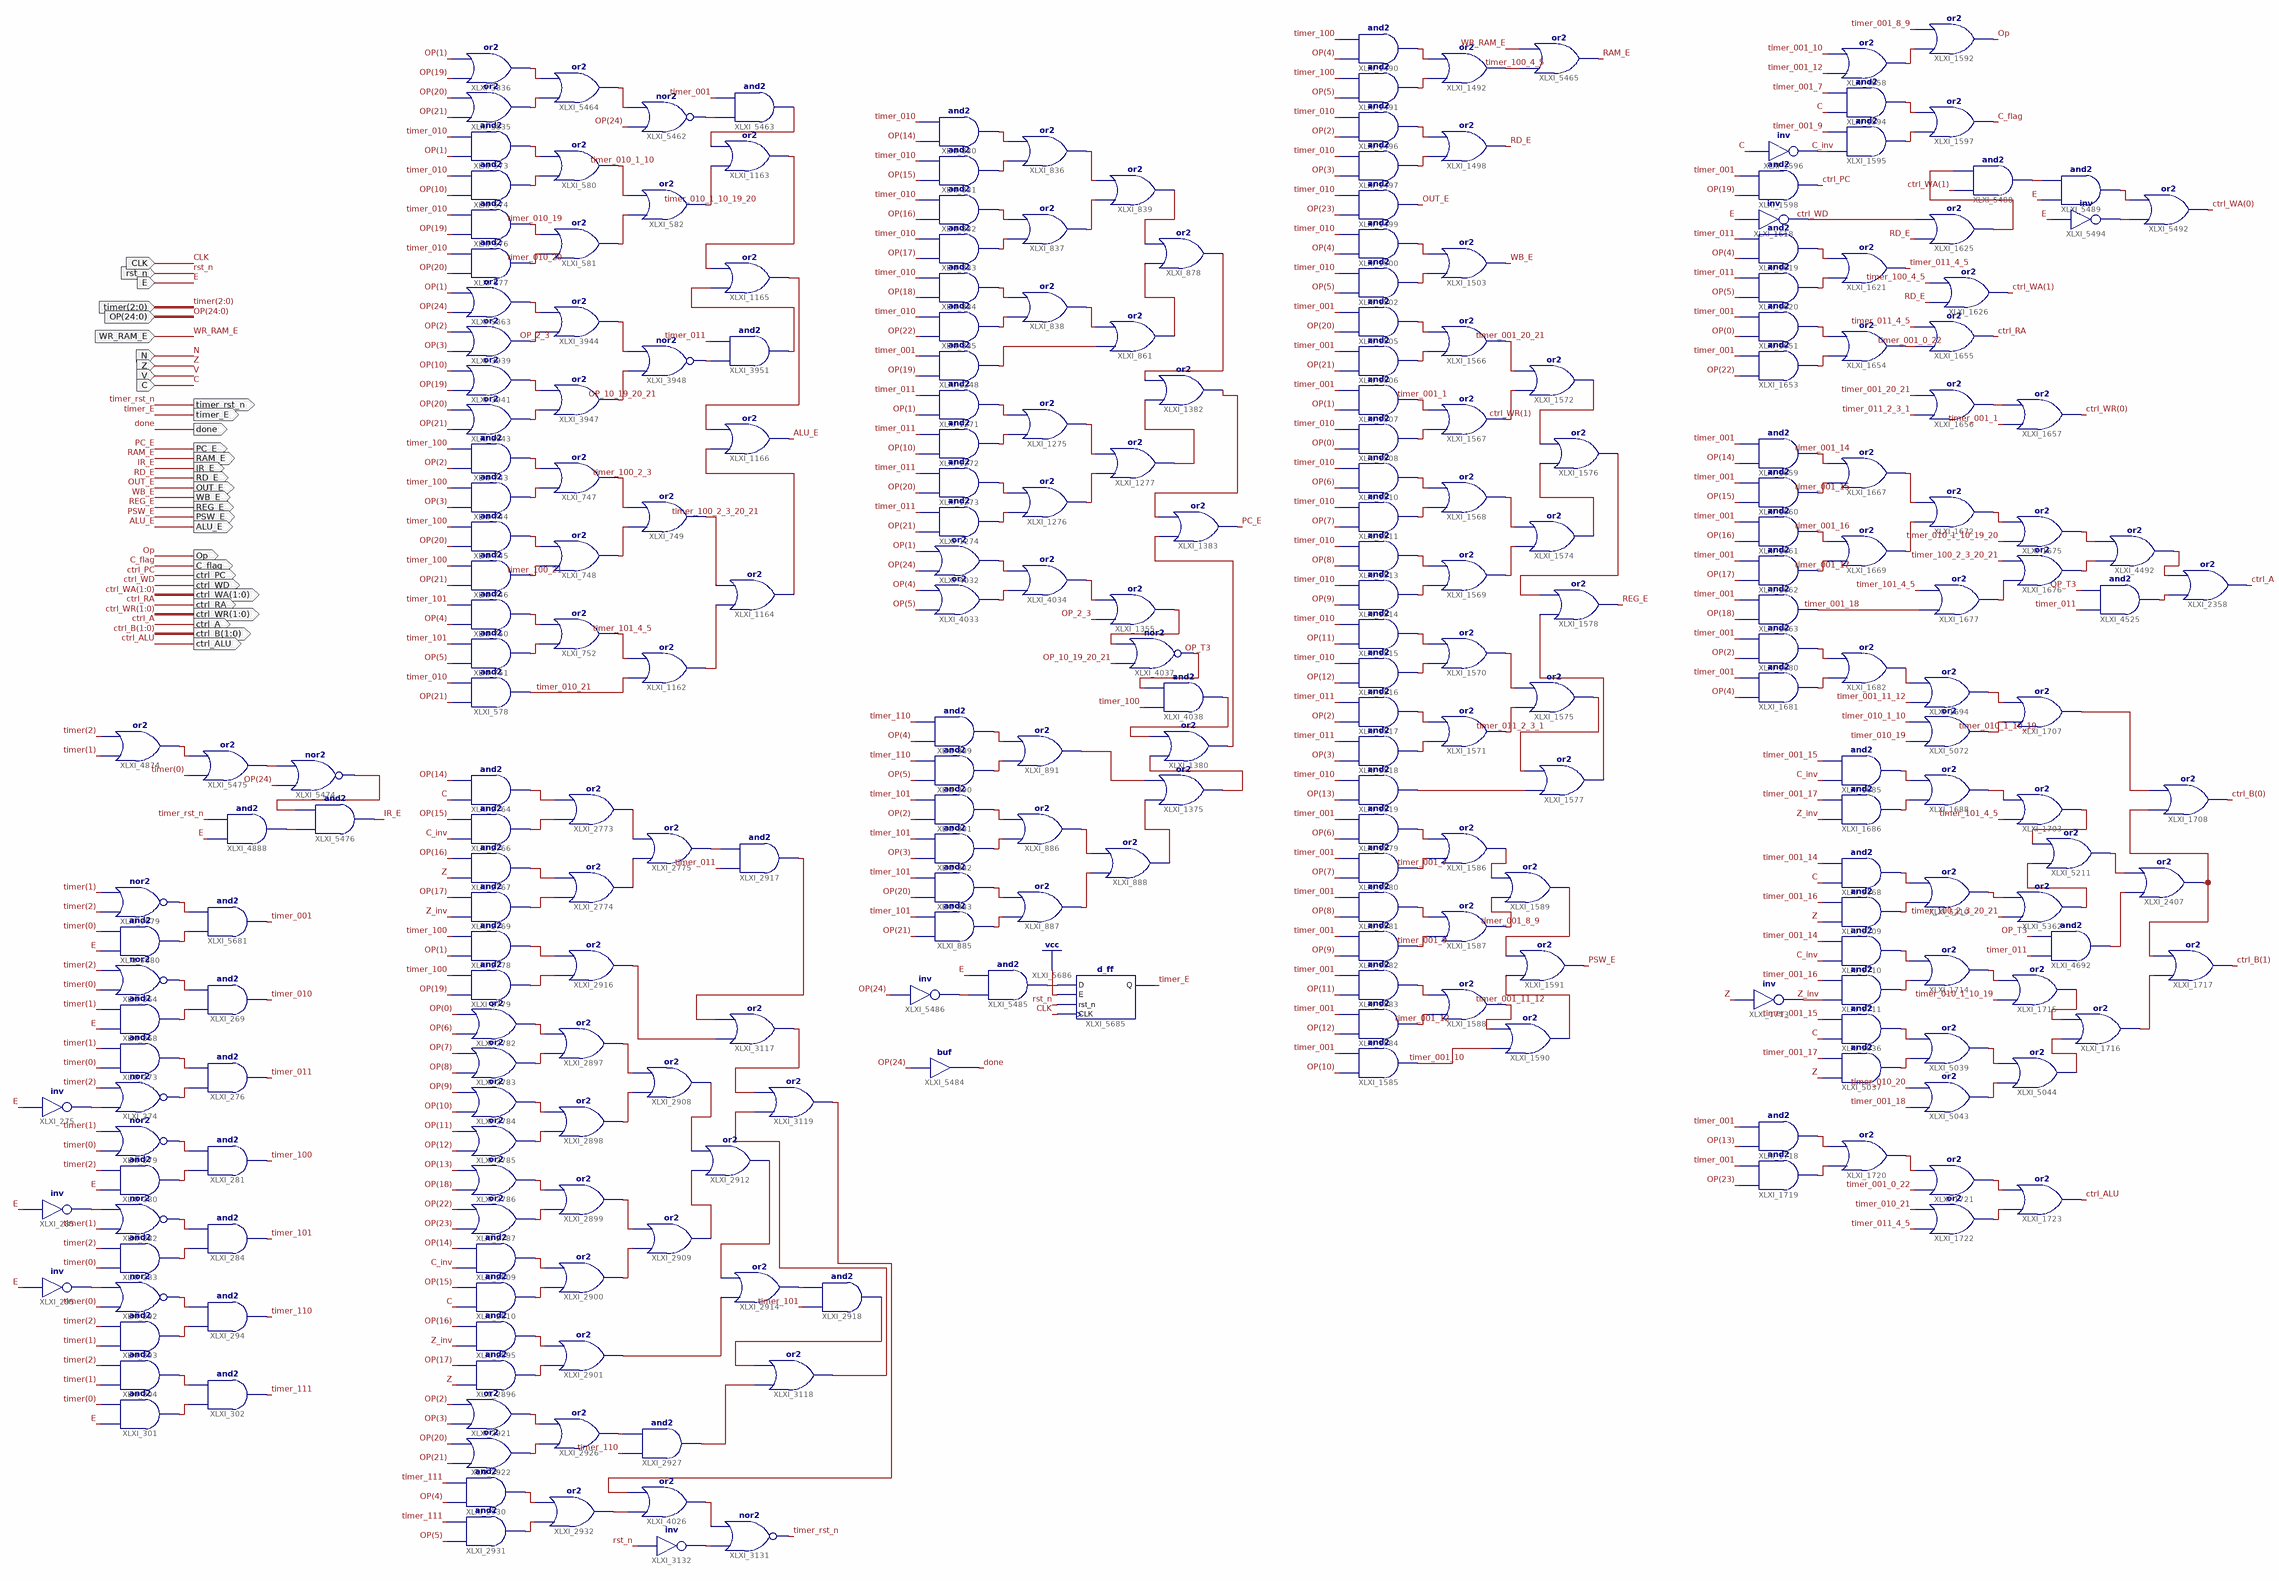
[diagram p0: schematic sheet 1]
// Xilinx ISE schematic Controller_16bit.sch (virtex6) as structural Verilog: 275 symbols, 32 ports
module Controller_16bit (
  input  Z,
  input  C,
  input  E,
  input  N,
  input  V,
  input  rst_n,
  input  WR_RAM_E,
  input  [2:0] timer,
  input  [24:0] Op,
  input  CLK,
  output Op_1bit,
  output PC_E,
  output RAM_E,
  output RD_E,
  output OUT_E,
  output WB_E,
  output REG_E,
  output PSW_E,
  output ALU_E,
  output C_flag,
  output ctrl_PC,
  output ctrl_WD,
  output ctrl_RA,
  output ctrl_A,
  output ctrl_ALU,
  output IR_E,
  output timer_rst_n,
  output done,
  output [1:0] ctrl_WA,
  output [1:0] ctrl_WR,
  output [1:0] ctrl_B,
  output timer_E
);

  wire C_inv, OP_2_3, OP_10_19_20_21, OP_T3, timer_001, timer_001_0_22, timer_001_1, timer_001_7,
       timer_001_8_9, timer_001_9, timer_001_10, timer_001_11_12, timer_001_12, timer_001_14, timer_001_15,
       timer_001_16, timer_001_17, timer_001_18, timer_001_20_21, timer_010, timer_010_1_10,
       timer_010_1_10_19, timer_010_1_10_19_20, timer_010_19, timer_010_20, timer_010_21, timer_011,
       timer_011_2_3_1, timer_011_4_5, timer_100, timer_100_2_3, timer_100_2_3_20_21, timer_100_4_5,
       timer_100_21, timer_101, timer_101_4_5, timer_110, timer_111, XLXN_640, XLXN_678, XLXN_690, XLXN_709,
       XLXN_710, XLXN_712, XLXN_729, XLXN_731, XLXN_737, XLXN_739, XLXN_741, XLXN_758, XLXN_760, XLXN_762,
       XLXN_776, XLXN_778, XLXN_1443, XLXN_1459, XLXN_1464, XLXN_1886, XLXN_1895, XLXN_1896, XLXN_2098,
       XLXN_2104, XLXN_2110, XLXN_2111, XLXN_2114, XLXN_2116, XLXN_2117, XLXN_2120, XLXN_2178, XLXN_2244,
       XLXN_2253, XLXN_2254, XLXN_2257, XLXN_2259, XLXN_2260, XLXN_2268, XLXN_2269, XLXN_2887, XLXN_2888,
       XLXN_2889, XLXN_2961, XLXN_2963, XLXN_2964, XLXN_2965, XLXN_2966, XLXN_3243, XLXN_3249, XLXN_3252,
       XLXN_3255, XLXN_3257, XLXN_3258, XLXN_3510, XLXN_3526, XLXN_3527, XLXN_3532, XLXN_3533, XLXN_3534,
       XLXN_3543, XLXN_3544, XLXN_3803, XLXN_3812, XLXN_3813, XLXN_3826, XLXN_3829, XLXN_3841, XLXN_3844,
       XLXN_3853, XLXN_3868, XLXN_3877, XLXN_3883, XLXN_3889, XLXN_3892, XLXN_4027, XLXN_4033, XLXN_4036,
       XLXN_4038, XLXN_4039, XLXN_4042, XLXN_4051, XLXN_4054, XLXN_4057, XLXN_4058, XLXN_4060, XLXN_4064,
       XLXN_4087, XLXN_4090, XLXN_4093, XLXN_4096, XLXN_4102, XLXN_4103, XLXN_4125, XLXN_4129, XLXN_4188,
       XLXN_4191, XLXN_4272, XLXN_4275, XLXN_4282, XLXN_4321, XLXN_4328, XLXN_4330, XLXN_4351, XLXN_4372,
       XLXN_4375, XLXN_4386, XLXN_4392, XLXN_4394, XLXN_4412, XLXN_4418, XLXN_4466, XLXN_4471, XLXN_4474,
       XLXN_4477, XLXN_4489, XLXN_4490, XLXN_4492, XLXN_4497, XLXN_4498, XLXN_5969, XLXN_6078, XLXN_7046,
       XLXN_7047, XLXN_7048, XLXN_7049, XLXN_7050, XLXN_7051, XLXN_7052, XLXN_7060, XLXN_7061, XLXN_7067,
       XLXN_7073, XLXN_7079, XLXN_7337, XLXN_7339, XLXN_7340, XLXN_7343, XLXN_7345, XLXN_7346, XLXN_7349,
       XLXN_7351, XLXN_7352, XLXN_7354, XLXN_7373, XLXN_7376, XLXN_7385, XLXN_7386, XLXN_7388, XLXN_7390,
       XLXN_7402, XLXN_7412, XLXN_7414, XLXN_7425, XLXN_7426, XLXN_7844, XLXN_7845, XLXN_7848, XLXN_7849,
       XLXN_7850, XLXN_7851, XLXN_7873, XLXN_7874, XLXN_7876, XLXN_7879, XLXN_9360, XLXN_9784, XLXN_9803,
       XLXN_10040, XLXN_10050, XLXN_10053, XLXN_10059, XLXN_10252, XLXN_10253, XLXN_10256, XLXN_10268,
       XLXN_10284, XLXN_11441, XLXN_11442, XLXN_11485, XLXN_11496, XLXN_11509, XLXN_11886, XLXN_12575,
       XLXN_12766, XLXN_12767, XLXN_12775, XLXN_12776, XLXN_12777, XLXN_13249, XLXN_13250, XLXN_13256,
       XLXN_13258, XLXN_13283, XLXN_13622, XLXN_13627, XLXN_13879, XLXN_13891, XLXN_14120, XLXN_14130,
       XLXN_14132, XLXN_14149, XLXN_14151, XLXN_14152, XLXN_14214, XLXN_14219, XLXN_14229, XLXN_14235,
       XLXN_14752, XLXN_14804, XLXN_14805, XLXN_14819, Z_inv;

  and XLXI_2764 (XLXN_7046, C, Op[14]);
  and XLXI_2766 (XLXN_7047, C_inv, Op[15]);
  and XLXI_2767 (XLXN_7048, Z, Op[16]);
  and XLXI_2769 (XLXN_7049, Z_inv, Op[17]);
  or XLXI_2774 (XLXN_7051, XLXN_7049, XLXN_7048);
  or XLXI_2775 (XLXN_7052, XLXN_7051, XLXN_7050);
  and XLXI_2778 (XLXN_7060, Op[1], timer_100);
  and XLXI_2779 (XLXN_7061, Op[19], timer_100);
  or XLXI_2782 (XLXN_7340, Op[6], Op[0]);
  or XLXI_2783 (XLXN_7067, Op[8], Op[7]);
  or XLXI_2784 (XLXN_7343, Op[10], Op[9]);
  or XLXI_2785 (XLXN_7073, Op[12], Op[11]);
  or XLXI_2786 (XLXN_7346, Op[18], Op[13]);
  or XLXI_2787 (XLXN_7079, Op[23], Op[22]);
  or XLXI_2897 (XLXN_7373, XLXN_7067, XLXN_7340);
  or XLXI_2898 (XLXN_7345, XLXN_7073, XLXN_7343);
  or XLXI_2899 (XLXN_7376, XLXN_7079, XLXN_7346);
  and XLXI_2809 (XLXN_7349, C_inv, Op[14]);
  and XLXI_2810 (XLXN_7337, C, Op[15]);
  and XLXI_2895 (XLXN_7352, Z_inv, Op[16]);
  and XLXI_2896 (XLXN_7339, Z, Op[17]);
  or XLXI_2900 (XLXN_7351, XLXN_7337, XLXN_7349);
  or XLXI_2901 (XLXN_7354, XLXN_7339, XLXN_7352);
  or XLXI_2908 (XLXN_7385, XLXN_7345, XLXN_7373);
  or XLXI_2909 (XLXN_7386, XLXN_7351, XLXN_7376);
  or XLXI_2912 (XLXN_7388, XLXN_7386, XLXN_7385);
  or XLXI_2914 (XLXN_7390, XLXN_7354, XLXN_7388);
  or XLXI_2916 (XLXN_7844, XLXN_7061, XLXN_7060);
  and XLXI_2917 (XLXN_7845, timer_011, XLXN_7052);
  and XLXI_2918 (XLXN_7848, timer_101, XLXN_7390);
  or XLXI_2921 (XLXN_7412, Op[3], Op[2]);
  or XLXI_2922 (XLXN_7402, Op[21], Op[20]);
  or XLXI_2926 (XLXN_7414, XLXN_7402, XLXN_7412);
  or XLXI_3117 (XLXN_7850, XLXN_7844, XLXN_7845);
  or XLXI_3118 (XLXN_7851, XLXN_7849, XLXN_7848);
  or XLXI_2773 (XLXN_7050, XLXN_7047, XLXN_7046);
  and XLXI_2930 (XLXN_7426, Op[4], timer_111);
  and XLXI_2931 (XLXN_7425, Op[5], timer_111);
  or XLXI_3119 (XLXN_7874, XLXN_7851, XLXN_7850);
  or XLXI_2932 (XLXN_7873, XLXN_7425, XLXN_7426);
  or XLXI_4026 (XLXN_7879, XLXN_7873, XLXN_7874);
  not XLXI_3132 (XLXN_7876, rst_n);
  nor XLXI_3131 (timer_rst_n, XLXN_7876, XLXN_7879);
  and XLXI_2927 (XLXN_7849, timer_110, XLXN_7414);
  and XLXI_1490 (XLXN_3812, Op[4], timer_100);
  and XLXI_1491 (XLXN_3813, Op[5], timer_100);
  or XLXI_1492 (timer_100_4_5, XLXN_3813, XLXN_3812);
  and XLXI_1496 (XLXN_3829, Op[2], timer_010);
  and XLXI_1497 (XLXN_3826, Op[3], timer_010);
  or XLXI_1498 (RD_E, XLXN_3826, XLXN_3829);
  and XLXI_1499 (OUT_E, Op[23], timer_010);
  and XLXI_1500 (XLXN_3844, Op[4], timer_010);
  and XLXI_1502 (XLXN_3841, Op[5], timer_010);
  or XLXI_1503 (WB_E, XLXN_3841, XLXN_3844);
  and XLXI_1505 (XLXN_4027, Op[20], timer_001);
  and XLXI_1506 (XLXN_3853, Op[21], timer_001);
  and XLXI_1507 (timer_001_1, Op[1], timer_001);
  and XLXI_1510 (XLXN_4033, Op[6], timer_010);
  and XLXI_1511 (XLXN_3868, Op[7], timer_010);
  and XLXI_1513 (XLXN_4036, Op[8], timer_010);
  and XLXI_1514 (XLXN_3877, Op[9], timer_010);
  and XLXI_1515 (XLXN_4039, Op[11], timer_010);
  and XLXI_1516 (XLXN_3883, Op[12], timer_010);
  and XLXI_1517 (XLXN_4042, Op[2], timer_011);
  and XLXI_1518 (XLXN_3889, Op[3], timer_011);
  and XLXI_1519 (XLXN_3892, Op[13], timer_010);
  or XLXI_1566 (timer_001_20_21, XLXN_3853, XLXN_4027);
  or XLXI_1567 (ctrl_WR[1], XLXN_9360, timer_001_1);
  or XLXI_1568 (XLXN_4051, XLXN_3868, XLXN_4033);
  or XLXI_1569 (XLXN_4038, XLXN_3877, XLXN_4036);
  or XLXI_1570 (XLXN_4054, XLXN_3883, XLXN_4039);
  or XLXI_1571 (timer_011_2_3_1, XLXN_3889, XLXN_4042);
  or XLXI_1572 (XLXN_4057, ctrl_WR[1], timer_001_20_21);
  or XLXI_1574 (XLXN_4058, XLXN_4038, XLXN_4051);
  or XLXI_1575 (XLXN_4060, timer_011_2_3_1, XLXN_4054);
  or XLXI_1576 (XLXN_5969, XLXN_4058, XLXN_4057);
  or XLXI_1577 (XLXN_4064, XLXN_3892, XLXN_4060);
  or XLXI_1578 (REG_E, XLXN_4064, XLXN_5969);
  and XLXI_1579 (XLXN_4087, Op[6], timer_001);
  and XLXI_1580 (timer_001_7, Op[7], timer_001);
  and XLXI_1581 (XLXN_4090, Op[8], timer_001);
  and XLXI_1582 (timer_001_9, Op[9], timer_001);
  and XLXI_1583 (XLXN_4093, Op[11], timer_001);
  and XLXI_1584 (timer_001_12, Op[12], timer_001);
  and XLXI_1585 (timer_001_10, Op[10], timer_001);
  or XLXI_1590 (XLXN_4103, timer_001_10, timer_001_11_12);
  or XLXI_1591 (PSW_E, XLXN_4103, XLXN_4102);
  or XLXI_1589 (XLXN_4102, timer_001_8_9, XLXN_4096);
  or XLXI_1586 (XLXN_4096, timer_001_7, XLXN_4087);
  or XLXI_1587 (timer_001_8_9, timer_001_9, XLXN_4090);
  or XLXI_1588 (timer_001_11_12, timer_001_12, XLXN_4093);
  and XLXI_1508 (XLXN_9360, Op[0], timer_010);
  and XLXI_830 (XLXN_2111, Op[14], timer_010);
  and XLXI_831 (XLXN_2098, Op[15], timer_010);
  and XLXI_832 (XLXN_2114, Op[16], timer_010);
  and XLXI_833 (XLXN_2104, Op[17], timer_010);
  and XLXI_834 (XLXN_2117, Op[18], timer_010);
  and XLXI_835 (XLXN_2110, Op[22], timer_010);
  or XLXI_836 (XLXN_2120, XLXN_2098, XLXN_2111);
  or XLXI_837 (XLXN_2116, XLXN_2104, XLXN_2114);
  or XLXI_838 (XLXN_2178, XLXN_2110, XLXN_2117);
  and XLXI_1271 (XLXN_3252, Op[1], timer_011);
  and XLXI_1272 (XLXN_3243, Op[10], timer_011);
  and XLXI_1273 (XLXN_3255, Op[20], timer_011);
  or XLXI_1275 (XLXN_3258, XLXN_3243, XLXN_3252);
  or XLXI_1276 (XLXN_3257, XLXN_3249, XLXN_3255);
  or XLXI_1277 (XLXN_3534, XLXN_3257, XLXN_3258);
  and XLXI_1248 (XLXN_3532, Op[19], timer_001);
  or XLXI_1382 (XLXN_3543, XLXN_3534, XLXN_3533);
  or XLXI_861 (XLXN_4351, XLXN_3532, XLXN_2178);
  or XLXI_839 (XLXN_3803, XLXN_2116, XLXN_2120);
  or XLXI_878 (XLXN_3533, XLXN_4351, XLXN_3803);
  and XLXI_1274 (XLXN_3249, Op[21], timer_011);
  or XLXI_4032 (XLXN_10253, Op[24], Op[1]);
  or XLXI_4033 (XLXN_10252, Op[5], Op[4]);
  or XLXI_4034 (XLXN_10256, XLXN_10252, XLXN_10253);
  or XLXI_1355 (XLXN_10268, OP_2_3, XLXN_10256);
  and XLXI_4038 (XLXN_3526, timer_100, OP_T3);
  nor XLXI_4037 (OP_T3, OP_10_19_20_21, XLXN_10268);
  and XLXI_881 (XLXN_2254, Op[2], timer_101);
  and XLXI_882 (XLXN_2244, Op[3], timer_101);
  and XLXI_883 (XLXN_2257, Op[20], timer_101);
  and XLXI_885 (XLXN_2253, Op[21], timer_101);
  or XLXI_886 (XLXN_2260, XLXN_2244, XLXN_2254);
  or XLXI_887 (XLXN_2259, XLXN_2253, XLXN_2257);
  or XLXI_888 (XLXN_3510, XLXN_2259, XLXN_2260);
  and XLXI_889 (XLXN_2269, Op[4], timer_110);
  and XLXI_890 (XLXN_2268, Op[5], timer_110);
  or XLXI_891 (XLXN_10284, XLXN_2268, XLXN_2269);
  or XLXI_1375 (XLXN_3527, XLXN_3510, XLXN_10284);
  or XLXI_1383 (PC_E, XLXN_3544, XLXN_3543);
  or XLXI_1380 (XLXN_3544, XLXN_3527, XLXN_3526);
  or XLXI_1592 (Op_1bit, XLXN_12575, timer_001_8_9);
  or XLXI_4958 (XLXN_12575, timer_001_12, timer_001_10);
  and XLXI_1680 (XLXN_4375, Op[2], timer_001);
  and XLXI_1681 (XLXN_4372, Op[4], timer_001);
  or XLXI_1682 (XLXN_4418, XLXN_4372, XLXN_4375);
  or XLXI_1694 (XLXN_4412, timer_001_11_12, XLXN_4418);
  or XLXI_1707 (XLXN_13879, timer_010_1_10_19, XLXN_4412);
  or XLXI_4492 (XLXN_11509, XLXN_11442, XLXN_11441);
  and XLXI_4525 (XLXN_11496, timer_011, OP_T3);
  or XLXI_2358 (ctrl_A, XLXN_11496, XLXN_11509);
  and XLXI_1663 (timer_001_18, Op[18], timer_001);
  or XLXI_1676 (XLXN_11442, XLXN_11485, timer_100_2_3_20_21);
  or XLXI_1677 (XLXN_11485, timer_001_18, timer_101_4_5);
  or XLXI_1675 (XLXN_11441, timer_010_1_10_19_20, XLXN_4330);
  and XLXI_1659 (timer_001_14, Op[14], timer_001);
  and XLXI_1660 (timer_001_15, Op[15], timer_001);
  and XLXI_1661 (timer_001_16, Op[16], timer_001);
  and XLXI_1662 (timer_001_17, Op[17], timer_001);
  or XLXI_1667 (XLXN_4328, timer_001_15, timer_001_14);
  or XLXI_1669 (XLXN_4321, timer_001_17, timer_001_16);
  or XLXI_1672 (XLXN_4330, XLXN_4321, XLXN_4328);
  and XLXI_1594 (XLXN_4129, C, timer_001_7);
  and XLXI_1595 (XLXN_4125, C_inv, timer_001_9);
  or XLXI_1597 (C_flag, XLXN_4125, XLXN_4129);
  and XLXI_1598 (ctrl_PC, Op[19], timer_001);
  not XLXI_1618 (ctrl_WD, E);
  and XLXI_1619 (XLXN_4191, Op[4], timer_011);
  and XLXI_1620 (XLXN_4188, Op[5], timer_011);
  or XLXI_1621 (timer_011_4_5, XLXN_4188, XLXN_4191);
  or XLXI_1625 (XLXN_14752, RD_E, ctrl_WD);
  and XLXI_1651 (XLXN_4275, Op[0], timer_001);
  and XLXI_1653 (XLXN_4272, Op[22], timer_001);
  or XLXI_1654 (timer_001_0_22, XLXN_4272, XLXN_4275);
  or XLXI_1655 (ctrl_RA, timer_001_0_22, timer_011_4_5);
  or XLXI_1656 (XLXN_4282, timer_011_2_3_1, timer_001_20_21);
  or XLXI_1657 (ctrl_WR[0], timer_001_1, XLXN_4282);
  not XLXI_1596 (C_inv, C);
  or XLXI_1708 (ctrl_B[0], XLXN_13283, XLXN_13879);
  and XLXI_1685 (XLXN_4392, C_inv, timer_001_15);
  and XLXI_1686 (XLXN_4386, Z_inv, timer_001_17);
  or XLXI_1688 (XLXN_4394, XLXN_4386, XLXN_4392);
  or XLXI_1703 (XLXN_13256, timer_101_4_5, XLXN_4394);
  or XLXI_5072 (timer_010_1_10_19, timer_010_19, timer_010_1_10);
  and XLXI_5168 (XLXN_13249, C, timer_001_14);
  or XLXI_1717 (ctrl_B[1], XLXN_6078, XLXN_13283);
  not XLXI_1713 (Z_inv, Z);
  and XLXI_1710 (XLXN_4471, C_inv, timer_001_14);
  and XLXI_1711 (XLXN_4466, Z_inv, timer_001_16);
  or XLXI_1714 (XLXN_4474, XLXN_4466, XLXN_4471);
  or XLXI_1715 (XLXN_4477, timer_010_1_10_19, XLXN_4474);
  and XLXI_5036 (XLXN_12766, C, timer_001_15);
  and XLXI_5037 (XLXN_12767, Z, timer_001_17);
  or XLXI_5039 (XLXN_12775, XLXN_12767, XLXN_12766);
  or XLXI_1716 (XLXN_6078, XLXN_12777, XLXN_4477);
  and XLXI_5209 (XLXN_13250, Z, timer_001_16);
  or XLXI_5210 (XLXN_13622, XLXN_13250, XLXN_13249);
  or XLXI_5044 (XLXN_12777, XLXN_12776, XLXN_12775);
  or XLXI_5211 (XLXN_13258, XLXN_13627, XLXN_13256);
  or XLXI_5043 (XLXN_12776, timer_001_18, timer_010_20);
  or XLXI_2407 (XLXN_13283, XLXN_11886, XLXN_13258);
  and XLXI_4692 (XLXN_11886, timer_011, OP_T3);
  or XLXI_5362 (XLXN_13627, timer_100_2_3_20_21, XLXN_13622);
  or XLXI_1722 (XLXN_4497, timer_011_4_5, timer_010_21);
  or XLXI_1723 (ctrl_ALU, XLXN_4497, XLXN_4498);
  or XLXI_1721 (XLXN_4498, timer_001_0_22, XLXN_4492);
  or XLXI_1720 (XLXN_4492, XLXN_4490, XLXN_4489);
  and XLXI_1719 (XLXN_4490, Op[23], timer_001);
  and XLXI_1718 (XLXN_4489, Op[13], timer_001);
  and XLXI_573 (XLXN_1459, Op[1], timer_010);
  and XLXI_574 (XLXN_1443, Op[10], timer_010);
  and XLXI_576 (timer_010_19, Op[19], timer_010);
  and XLXI_577 (timer_010_20, Op[20], timer_010);
  or XLXI_580 (timer_010_1_10, XLXN_1443, XLXN_1459);
  or XLXI_581 (XLXN_1464, timer_010_20, timer_010_19);
  or XLXI_582 (timer_010_1_10_19_20, XLXN_1464, timer_010_1_10);
  or XLXI_1165 (XLXN_2965, XLXN_2964, XLXN_2963);
  or XLXI_3939 (OP_2_3, Op[3], Op[2]);
  or XLXI_3941 (XLXN_10050, Op[19], Op[10]);
  or XLXI_3944 (XLXN_10053, OP_2_3, XLXN_13891);
  nor XLXI_3948 (XLXN_10059, OP_10_19_20_21, XLXN_10053);
  or XLXI_3943 (XLXN_10040, Op[21], Op[20]);
  or XLXI_3947 (OP_10_19_20_21, XLXN_10040, XLXN_10050);
  and XLXI_3951 (XLXN_2964, XLXN_10059, timer_011);
  and XLXI_743 (XLXN_2889, Op[2], timer_100);
  and XLXI_744 (XLXN_2888, Op[3], timer_100);
  and XLXI_745 (XLXN_2887, Op[20], timer_100);
  and XLXI_746 (timer_100_21, Op[21], timer_100);
  or XLXI_747 (timer_100_2_3, XLXN_2888, XLXN_2889);
  or XLXI_748 (XLXN_1886, timer_100_21, XLXN_2887);
  or XLXI_749 (timer_100_2_3_20_21, XLXN_1886, timer_100_2_3);
  and XLXI_750 (XLXN_1896, Op[4], timer_101);
  and XLXI_751 (XLXN_1895, Op[5], timer_101);
  or XLXI_752 (timer_101_4_5, XLXN_1895, XLXN_1896);
  and XLXI_578 (timer_010_21, Op[21], timer_010);
  or XLXI_1162 (XLXN_2961, timer_010_21, timer_101_4_5);
  or XLXI_1166 (ALU_E, XLXN_2966, XLXN_2965);
  or XLXI_1164 (XLXN_2966, XLXN_2961, timer_100_2_3_20_21);
  or XLXI_5363 (XLXN_13891, Op[24], Op[1]);
  or XLXI_3835 (XLXN_9784, Op[21], Op[20]);
  or XLXI_3836 (XLXN_9803, Op[19], Op[1]);
  and XLXI_5463 (XLXN_14132, XLXN_14130, timer_001);
  or XLXI_1163 (XLXN_2963, timer_010_1_10_19_20, XLXN_14132);
  nor XLXI_5462 (XLXN_14130, Op[24], XLXN_14120);
  or XLXI_5464 (XLXN_14120, XLXN_9784, XLXN_9803);
  or XLXI_4874 (XLXN_640, timer[1], timer[2]);
  or XLXI_5475 (XLXN_14149, timer[0], XLXN_640);
  and XLXI_5476 (IR_E, XLXN_14151, XLXN_14152);
  nor XLXI_5474 (XLXN_14152, Op[24], XLXN_14149);
  and XLXI_4888 (XLXN_14151, E, timer_rst_n);
  and XLXI_5485 (XLXN_14819, XLXN_14214, E);
  not XLXI_5486 (XLXN_14214, Op[24]);
  and XLXI_5488 (XLXN_14219, ctrl_WA[1], XLXN_14752);
  and XLXI_5489 (XLXN_14229, E, XLXN_14219);
  or XLXI_5492 (ctrl_WA[0], XLXN_14235, XLXN_14229);
  not XLXI_5494 (XLXN_14235, E);
  nor XLXI_264 (XLXN_678, timer[0], timer[2]);
  and XLXI_268 (XLXN_690, E, timer[1]);
  and XLXI_269 (timer_010, XLXN_690, XLXN_678);
  and XLXI_273 (XLXN_712, timer[0], timer[1]);
  nor XLXI_274 (XLXN_709, XLXN_710, timer[2]);
  not XLXI_275 (XLXN_710, E);
  and XLXI_276 (timer_011, XLXN_709, XLXN_712);
  nor XLXI_279 (XLXN_729, timer[0], timer[1]);
  and XLXI_280 (XLXN_731, E, timer[2]);
  and XLXI_281 (timer_100, XLXN_731, XLXN_729);
  nor XLXI_282 (XLXN_737, timer[1], XLXN_741);
  and XLXI_283 (XLXN_739, timer[0], timer[2]);
  and XLXI_284 (timer_101, XLXN_739, XLXN_737);
  not XLXI_285 (XLXN_741, E);
  nor XLXI_292 (XLXN_758, timer[0], XLXN_762);
  and XLXI_293 (XLXN_760, timer[1], timer[2]);
  and XLXI_294 (timer_110, XLXN_760, XLXN_758);
  not XLXI_295 (XLXN_762, E);
  and XLXI_301 (XLXN_778, E, timer[0]);
  and XLXI_302 (timer_111, XLXN_778, XLXN_776);
  and XLXI_304 (XLXN_776, timer[1], timer[2]);
  nor XLXI_5679 (XLXN_14805, timer[2], timer[1]);
  and XLXI_5680 (XLXN_14804, E, timer[0]);
  and XLXI_5681 (timer_001, XLXN_14804, XLXN_14805);
  buf XLXI_5484 (done, Op[24]);
  d_ff XLXI_5685 (.E(1'b1), .D(XLXN_14819), .Q(timer_E), .CLK(CLK), .rst_n(rst_n));
  or XLXI_5465 (RAM_E, timer_100_4_5, WR_RAM_E);
  or XLXI_1626 (ctrl_WA[1], RD_E, timer_100_4_5);
endmodule
